# EAGLE schematic SN74HC165-schematic (EAGLE 9.2.2)
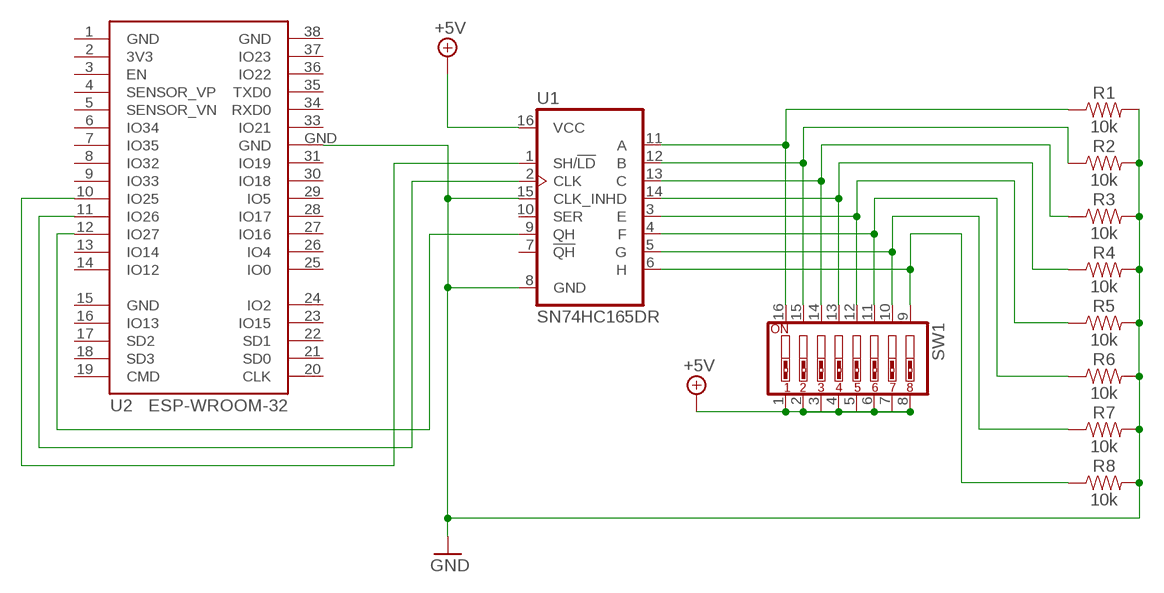
[diagram p0: schematic, sheet 1]

## Parts
R1  10k  10KOHM-0603-1/10W-1%  [0603]
R2  10k  10KOHM-0603-1/10W-1%  [0603]
R3  10k  10KOHM-0603-1/10W-1%  [0603]
R4  10k  10KOHM-0603-1/10W-1%  [0603]
R5  10k  10KOHM-0603-1/10W-1%  [0603]
R6  10k  10KOHM-0603-1/10W-1%  [0603]
R7  10k  10KOHM-0603-1/10W-1%  [0603]
R8  10k  10KOHM-0603-1/10W-1%  [0603]
SW1  SW_DIP-8  [EDG-08]
U1  SN74HC165DR  74HC165D  [SO16]
U2  ESP-WROOM-32  [ESP-WROOM-32]

## Nets
+5V: SW1.1 SW1.2 SW1.4 SW1.6 SW1.8 U1.16(VCC)
GND: R1.2 R2.2 R3.2 R4.2 R5.2 R6.2 R7.2 R8.2 U1.8(GND) U1.15(CLK_INH) U2.GND
N$1: R8.1 SW1.9 U1.6(H)
N$2: R7.1 SW1.10 U1.5(G)
N$3: R6.1 SW1.11 U1.4(F)
N$4: R5.1 SW1.12 U1.3(E)
N$5: R4.1 SW1.13 U1.14(D)
N$6: R3.1 SW1.14 U1.13(C)
N$7: R2.1 SW1.15 U1.12(B)
N$8: R1.1 SW1.16 U1.11(A)
N$9: U1.9(QH) U2.12(IO27)
N$10: U1.2(CLK) U2.11(IO26)
N$11: U1.1(SH/!LD) U2.10(IO25)
Unconnected: SW1.3 SW1.5 SW1.7 U1.7(!QH) U1.10(SER) U2.3(EN) U2.4(SENSOR_VP) U2.5(SENSOR_VN) U2.6(IO34) U2.7(IO35) U2.8(IO32) U2.9(IO33) U2.13(IO14) U2.14(IO12) U2.16(IO13) U2.17(SD2) U2.18(SD3) U2.19(CMD) U2.20(CLK) U2.21(SD0) U2.22(SD1) U2.23(IO15) U2.24(IO2) U2.25(IO0) U2.26(IO4) U2.27(IO16) U2.28(IO17) U2.29(IO5) U2.30(IO18) U2.31(IO19) U2.33(IO21) U2.34(RXD0) U2.35(TXD0) U2.36(IO22) U2.37(IO23)

## Power pins joined to a net without a drawn wire
3V3: U2.2(3V3)
GND: U2.1(GND) U2.15(GND) U2.38(GND)

## Library data of the parts
R1-R8 = SparkFun-Resistors:10KOHM: 10kΩ resistor A resistor is a passive two-terminal electrical component that implements electrical resistance as a circuit element. Resistors act to reduce current flow, and, at the same time, act to lower voltage levels within circuits. - Wikipedia; PROD_ID: RES-00824
SW1 = special:SW_DIP-8: DIP SWITCH
U1 = SparkFun-IC-Logic:74*165: 8-Bit Shift Register (Parallel to Serial) Datasheet <https://cdn.sparkfun.com/datasheets/BreakoutBoards/sn54hc165.pdf> SparkFun Products SparkFun Shift-In Breakout - SN74HC165 <https://www.sparkfun.com/products/11733> (BOB-11733); PROD_ID: IC-11325
U2 = esp32:ESP-WROOM-32: Espressif Systems ESP-WROOM-32